# EAGLE design NEO-M8T GNSS FeatherWing (EAGLE 8.2.2)
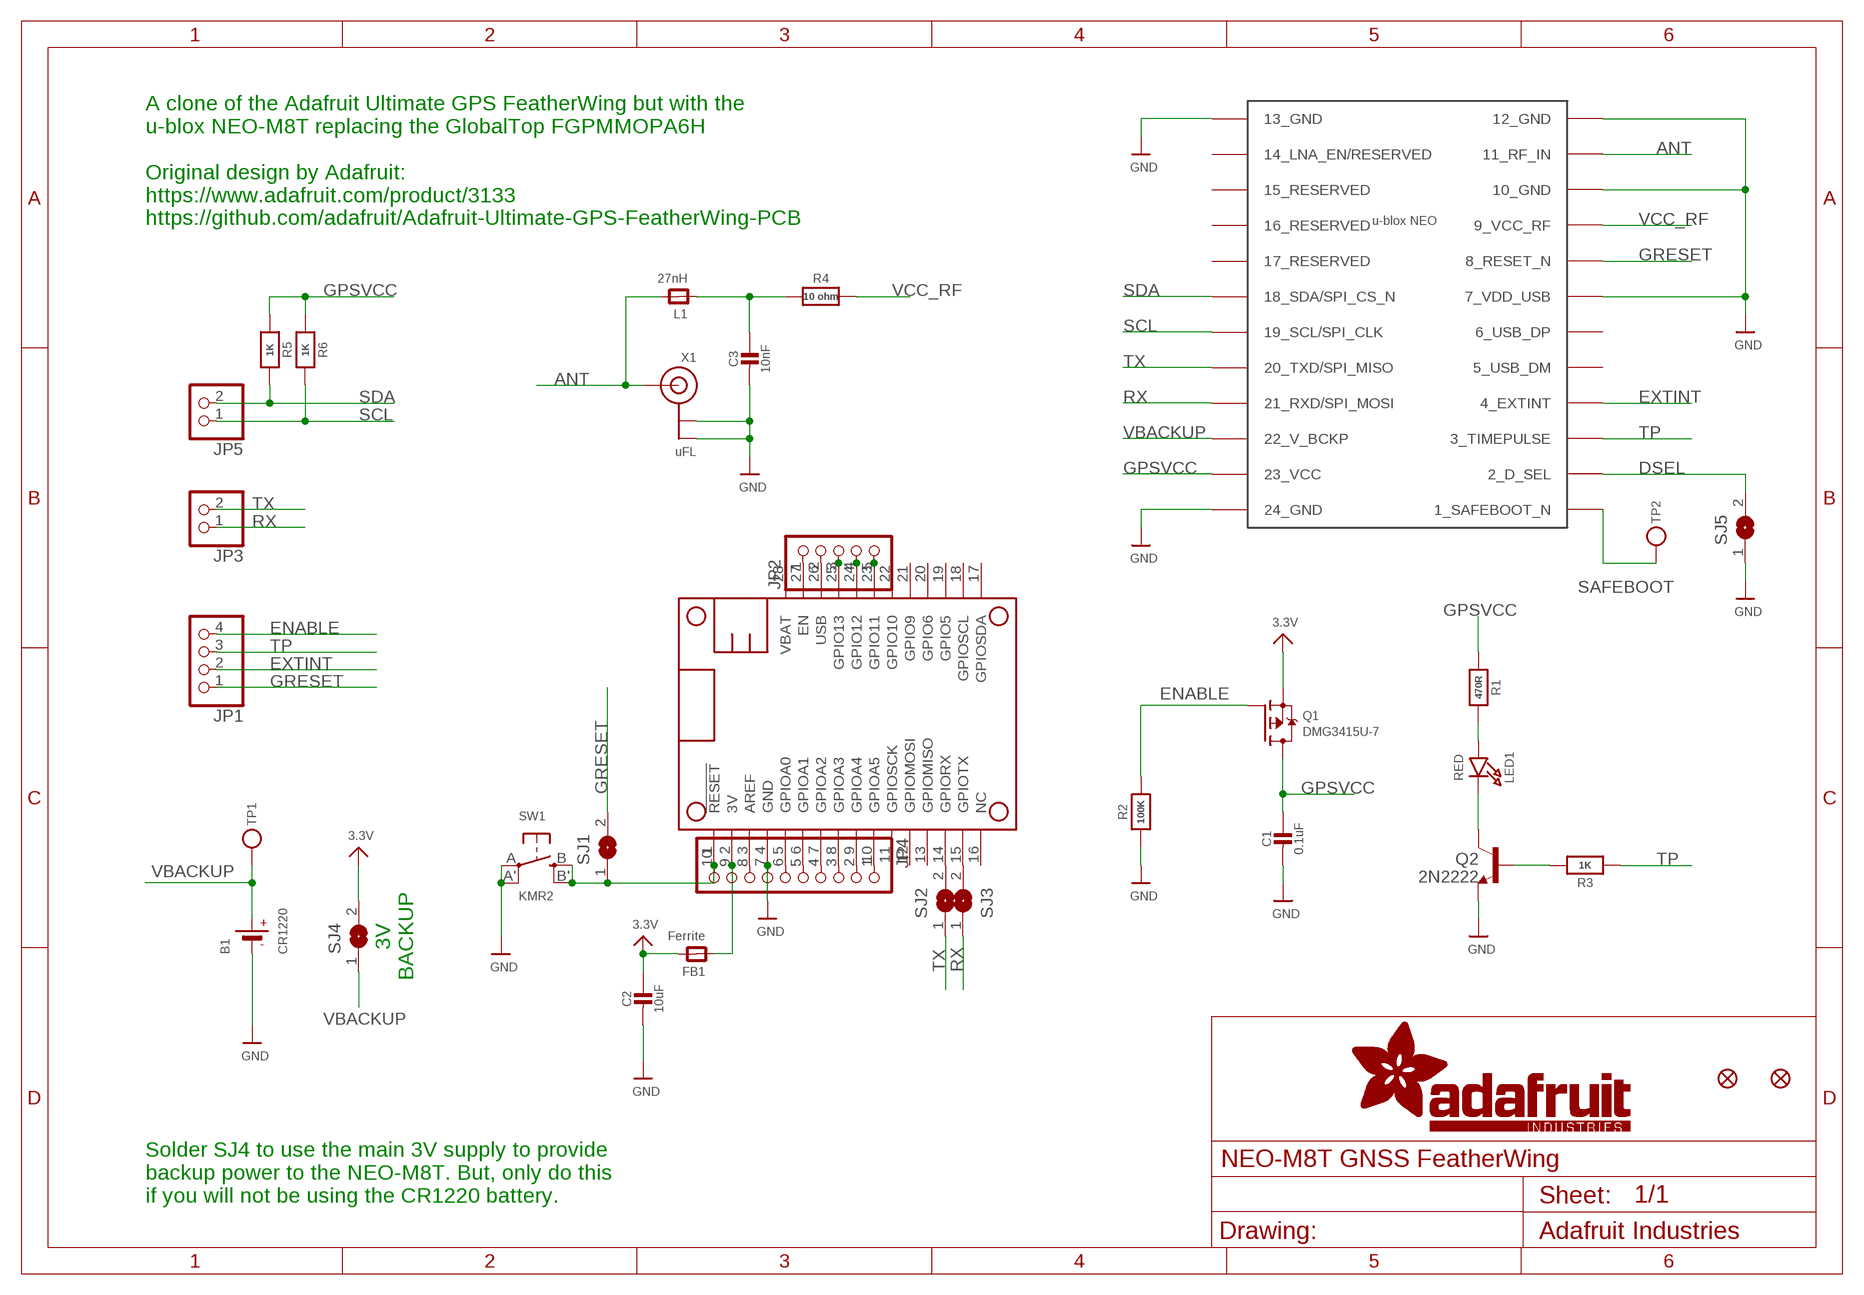
[diagram p0: schematic, sheet 1]

## Parts
B1  CR1220  BATTERYCR1220_2  [CR1220-2]
C1  0.1uF  CAP_CERAMIC0805-NOOUTLINE  [0805-NO]
C2  10uF  CAP_CERAMIC0805-NOOUTLINE  [0805-NO]
C3  10nF  CAP_CERAMIC0805-NOOUTLINE  [0805-NO]
FB1  Ferrite  FERRITE-0805NO  [0805-NO]
FID1  FIDUCIAL""  [FIDUCIAL_1MM]
FID2  FIDUCIAL""  [FIDUCIAL_1MM]
JP1  HEADER-1X4ROUND  [1X04_ROUND]
JP2  HEADER-1X570MIL  [1X05_ROUND_70]
JP3  HEADER-1X2ROUND  [1X02_ROUND]
JP4  HEADER-1X10ROUND  [1X10_ROUND]
JP5  HEADER-1X2ROUND  [1X02_ROUND]
L1  27nH  FERRITE-0805NO  [0805-NO]
LED1  RED  LED0805_NOOUTLINE  [CHIPLED_0805_NOOUTLINE]
MS1  FEATHERWING  [FEATHERWING]
Q1  DMG3415U-7  MOSFET-PWIDE  [SOT23-WIDE]
Q2  2N2222  MMBT2222ALT1-NPN-SOT23-BEC  [SOT23-BEC]
R1  470R  RESISTOR_0603_NOOUT  [0603-NO]
R2  100K  RESISTOR0805_NOOUTLINE  [0805-NO]
R3  1K  RESISTOR_0603_NOOUT  [0603-NO]
R4  10 ohm  RESISTOR0805_NOOUTLINE  [0805-NO]
R5  1K  RESISTOR_0603_NOOUT  [0603-NO]
R6  1K  RESISTOR_0603_NOOUT  [0603-NO]
SJ1  SOLDERJUMPER  [SOLDERJUMPER_ARROW_NOPASTE]
SJ2  SOLDERJUMPERCLOSED  [SOLDERJUMPER_CLOSEDWIRE]
SJ3  SOLDERJUMPERCLOSED  [SOLDERJUMPER_CLOSEDWIRE]
SJ4  SOLDERJUMPER  [SOLDERJUMPER_ARROW_NOPASTE]
SJ5  SOLDERJUMPER  [SOLDERJUMPER_ARROW_NOPASTE]
SW1  KMR2  SWITCH_TACT_SMT4.6X2.8  [BTN_KMR2_4.6X2.8]
TP1  TESTPOINTROUND1.5MM  [TESTPOINT_ROUND_1.5MM]
TP2  TESTPOINTROUND1.5MM  [TESTPOINT_ROUND_1.5MM]
U1  NEO-M8  [NEO-M8]
X1  uFL  ANTENNA_U.FL  [U.FL]

## Nets
3.3V: C2.1 FB1.2 Q1.2(S) SJ4.2
3V: FB1.1 JP4.9 MS1.2(3V)
ANT: L1.2 U1.11(11_RF_IN) X1.3(SIGNAL)
DSEL: SJ5.2 U1.2(2_D_SEL)
ENABLE: JP1.4 Q1.1(G) R2.2
EXTINT: JP1.2 U1.4(4_EXTINT)
GND: B1.- C1.2 C2.2 C3.2 JP4.7 MS1.4(GND) Q2.E R2.1 SJ5.1 SW1.A'(P1) SW1.A(P) U1.7(7_VDD_USB) U1.10(10_GND) U1.12(12_GND) U1.13(13_GND) U1.24(24_GND) X1.1(GND) X1.2(GND)
GPSVCC: C1.1 Q1.3(D) R1.1 R5.1 R6.1 U1.23(23_VCC)
GRESET: JP1.1 SJ1.2 U1.8(8_RESET_N)
N$1: JP2.3 MS1.25(GPIO13)
N$2: LED1.A R1.2
N$3: JP2.4 MS1.24(GPIO12)
N$4: C3.1 L1.1 R4.1
N$5: JP2.5 MS1.23(GPIO11)
N$6: JP4.1 MS1.10(GPIOA5)
N$7: JP4.2 MS1.9(GPIOA4)
N$8: JP4.3 MS1.8(GPIOA3)
N$9: JP4.4 MS1.7(GPIOA2)
N$10: JP4.5 MS1.6(GPIOA1)
N$11: JP4.6 MS1.5(GPIOA0)
N$13: JP4.8 MS1.3(AREF)
N$14: JP2.1 MS1.27(EN)
N$16: MS1.14(GPIORX) SJ2.2
N$17: MS1.15(GPIOTX) SJ3.2
N$18: LED1.C Q2.C
N$19: Q2.B R3.2
RST: JP4.10 MS1.1(!RESET) SJ1.1 SW1.B'(S1) SW1.B(S)
RX: JP3.1 SJ3.1 U1.21(21_RXD/SPI_MOSI)
SAFEBOOT: TP2.P$1 U1.1(1_SAFEBOOT_N)
SCL: JP5.1 R6.2 U1.19(19_SCL/SPI_CLK)
SDA: JP5.2 R5.2 U1.18(18_SDA/SPI_CS_N)
TP: JP1.3 R3.1 U1.3(3_TIMEPULSE)
TX: JP3.2 SJ2.1 U1.20(20_TXD/SPI_MISO)
USB: JP2.2 MS1.26(USB)
VBACKUP: B1.+ SJ4.1 TP1.P$1 U1.22(22_V_BCKP)
VCC_RF: R4.2 U1.9(9_VCC_RF)
Unconnected: MS1.11(GPIOSCK) MS1.12(GPIOMOSI) MS1.13(GPIOMISO) MS1.16(NC) MS1.17(GPIOSDA) MS1.18(GPIOSCL) MS1.19(GPIO5) MS1.20(GPIO6) MS1.21(GPIO9) MS1.22(GPIO10) MS1.28(VBAT) U1.5(5_USB_DM) U1.6(6_USB_DP) U1.14(14_LNA_EN/RESERVED) U1.15(15_RESERVED) U1.16(16_RESERVED) U1.17(17_RESERVED)

## Notes on the sheet
- A clone of the Adafruit Ultimate GPS FeatherWing but with the
  u-blox NEO-M8T replacing the GlobalTop FGPMMOPA6H
  
  Original design by Adafruit:
  https://www.adafruit.com/product/3133
  https://github.com/adafruit/Adafruit-Ultimate-GPS-FeatherWing-PCB
- 3V
  BACKUP
- Solder SJ4 to use the main 3V supply to provide
  backup power to the NEO-M8T. But, only do this
  if you will not be using the CR1220 battery.

## Library data of the parts
B1 = microbuilder:BATTERY: CR1220 SMT - Digikey: 3001K-ND CD2032 BAT-HLD-001 - Digikey: BAT-HLD-001-ND
C1-C3 = microbuilder:CAP_CERAMIC: Ceramic Capacitors For new designs, use the packages preceded by an '_' character since they are more reliable: The following footprints should be used on most boards: _0402 - Standard footprint for regular board layouts _0603 - Standard footprint for regular board layouts _0805 - Standard footprint for regular board layouts _1206 - Standard footprint for regular board layouts For extremely tight-pitch boards where space is at a premium, the following 'micro-pitch' footprints can be used (smaller pads, no silkscreen outline, etc.): _0402MP - Micro-pitch footprint for very dense/compact boards _0603MP - Micro-pitch footprint for very dense/compact boards _0805MP - Micro-pitch footprint for very dense/compact boards _1206MP - Micro-pitch footprint for very dense/compact boards
FB1 L1 = microbuilder:FERRITE: Ferrite Bead 0603 MMZ1608B121C - 120 Ohm @ 100MHz, 600mA, 0.15 Ohm DC Resistance - Digikey: 445-2164-1-ND BK1608HW121-T - 120 Ohm, 600mA Ferrite Chip - Digikey: 587-1876-2-ND 0805 HZ0805B272R-10 - 2.7K Ohm @ 100MHz, 200mA, 0.8 Ohm DC Resistance - Digikey: 240-2504-1-ND (see also Murata BLM21BD272SN1L) MMZ2012Y152B - 1.5K Ohm @ 100MHz, 500mA, 0.4 Ohm DC Resistance - Digikey: 445-1560-1-ND - Mainly for high frequency (80-400MHz) MMZ2012R102A - 1K Ohm @ 100MHz, 500mA, 0.3 Ohm DC Resistance - Digikey: 445-1555-2-ND - More general purpose (10-200MHz)
FID1 FID2 = microbuilder:FIDUCIAL: Fiducial Alignment Points Various fiducial points for machine vision alignment.; BOM: EXCLUDE
JP1 = microbuilder:HEADER-1X4: PIN HEADER
JP2 = microbuilder:HEADER-1X5: PIN HEADER
JP3 JP5 = microbuilder:HEADER-1X2: PIN HEADER
JP4 = microbuilder:HEADER-1X10: PIN HEADER
LED1 = microbuilder:LED: LED 0603 - 0603 Surface Mount Package 2mA: Green LED - Low Power (3.9mcd, 2ma, 1.7Vf) - Digikey: 475-2709-2-ND Orange LED - Low Power (9.8mcd, 2ma, 1.8Vf) - Digikey: 475-1194-2-ND Red LED - Low Power (5mcd, 2ma, 1.8Vf) - Digikey: 475-1195-2-ND Yellow LED - Low Power (7mcd, 2ma, 1.8Vf) - Digikey: 475-1196-2-ND 5mA: Blue LED - Low Power (17mcd, 5ma, 2.9Vf) - Digikey: LNJ937W8CRACT-ND 0805 - 0805 Surface Mount Package 2mA: Red LED (8.8mcd, 2mA, 1.8Vf, Clear) - Low Power [Digikey: 475-2510-1-ND] Green LED (5mcd, 2mA, 1.8Vf, Clear) - Low Power [Digikey: 475-2730-1-ND] Yellow LED (11.3mcd, 2mA, 1.8Vf, Clear) - Low Power [Digikey: 475-2555-1-ND] 20mA: Red LED (104mcd, 20mA, Diffused) - LS R976 [Digikey: 475-1278-6-ND] Red LED (12mcd, 20mA, 2.0Vf, Clear) - APT2012EC [Digikey: 754-1128-1-ND] Green LED (15mcd, 20mA, 2.2Vf, Clear) - APT2012GC [Digikey: 754-1131-1-ND] Orange LED (160mcd, 20mA, 2.1Vf, Clear) - APT2012SECK [Digikey: 754-1130-1-ND] 1206 - 1206 Surface Mount Package Green LED (26mcd, 20mA, Diffused) - LG N971 [Digikey: 475-1407-6-ND] Red LED (15mcd, 20mA, Diffused) - LH N974 [Digikey: 475-1416-6-ND] Cree - Cree High-Power Surface Mount LEDs XPEBWT-L1-0000-00D50 - White 111lm 350mA 2.9Vf 6200K 110° XTEAWT-00-0000-00000LEE3 - White 114lm 350mA 2.85Vf 5000K 115° Everlight - Everlight 45-21 Series Surface Mount LEDs 45-21/QK2C-B2832AC2CB2/2T - Warm White 2000mcd 20mA 3.25Vf 3050K 120° 45-21/LK2C-B38452C4CB2/2T - Nuetral White 2000mcd 20mA 3.25Vf 4150K 120° 45-21/LK2C-B50634C6CB2/2T - Cold White 2200mcd 20mA 3.25Vf 5650K 120° PLCC2 Reverse Mount LS T77K-J1L2-1-0-2-R18-Z - Red 11.25mcd 2mA 1.8Vf 630nm 120° LO T77K-L1M2-24-Z - Orange 19.6mcd 2mA 1.8Vf 606nm 120° LY T77K-K2M1-26-Z - Yellow 15.7mcd 2mA 1.8Vf 587nm 120°
MS1 = microbuilder:FEATHERWING
Q1 = microbuilder:MOSFET-P: P-Channel Mosfet LEGEND VDS: Voltage Drain-Source ID: Drain Current RDS(ON): Drain-Source On-State Resistance VGS(TH): Gate-Source Threshold Voltage CISS: Drain-Source Input Capacitance SOT-23 Name VDS ID RDS(ON) VGS(TH) CISS Order Number IRLML5103 30V 760mA 600 mOhm -- 75pF @ 25V Digikey: IRLML5103PBFCT-ND IRLML6401 12V 4.3A 50 mOhm 950mV @ 250µA 830pF @ 10V Digikey: IRLML6401PBFTR-ND NTR0202PL 20V 400mA 800 mOhm 2.3V @ 250uA 70pF @ 5V Digikey: NTR0202PLT1GOSTR-ND NTR4101PT1G 20V 1.8A 85 mOhm 1.2V @ 250uA 675pF @ 10V Digikey: NTR4101PT1GOSCT-ND DMP2004K 20V 600mA 900 mOhm 1V @ 250uA 175pF @ 16V Digikey: DMP2004KDICT-ND PMV65XP 20V 3.9A 76 mOhm 950mV @ 1mA 725pF @ 20V Digikey: 568-2358-2-ND TO-252 Name VDS ID RDS(ON) VGS(TH) CISS Order Number AOD417 30V 25A 34 mOhm 3V @ 250µA 920pF @ 15V Digikey: 785-1106-2-ND
Q2 = transistor:*-NPN-: NPN Transistror BF959 corrected 2008.03.06
R1-R6 = microbuilder:RESISTOR: Resistors For new designs, use the packages preceded by an '_' character since they are more reliable: The following footprints should be used on most boards: _0402 - Standard footprint for regular board layouts _0603 - Standard footprint for regular board layouts _0805 - Standard footprint for regular board layouts _1206 - Standard footprint for regular board layouts For extremely tight-pitch boards where space is at a premium, the following 'micro-pitch' footprints can be used (smaller pads, no silkscreen outline, etc.): _0402MP - Micro-pitch footprint for very dense/compact boards _0603MP - Micro-pitch footprint for very dense/compact boards _0805MP - Micro-pitch footprint for very dense/compact boards _1206MP - Micro-pitch footprint for very dense/compact boards
SJ1 SJ4 SJ5 = microbuilder:SOLDERJUMPER: SMD Solder JUMPER Solder the two pads together to create a connection, or remove the solder to break it. REFLOW - Use this footprint for solder paste and reflow ovens. WAVE - Use this footprint for hand-soldering (larger pads). CLOSED - Has a trace between the two pads to ensure it is closed by default. The trace needs to be cut to disable the jumper, and can be closed again by creating a solder bridge between the two pads.; BOM: EXCLUDE
SJ2 SJ3 = microbuilder:SOLDERJUMPER: SMD Solder JUMPER Solder the two pads together to create a connection, or remove the solder to break it. REFLOW - Use this footprint for solder paste and reflow ovens. WAVE - Use this footprint for hand-soldering (larger pads). CLOSED - Has a trace between the two pads to ensure it is closed by default. The trace needs to be cut to disable the jumper, and can be closed again by creating a solder bridge between the two pads.
SW1 = microbuilder:SWITCH_TACT_SMT: SMT Tact Switches 6x6mm - Digikey: P12940SCT-ND KMR2 (4.6x2.8mm) - Digikey: 401-1426-1-ND EVQ-PQHB55 - Light Touch, 160GF (4.5x4.5mm) - Digikey: P8090SCT-ND KMT0 - KMT021 NGJ LHS (etc.) IP68/Waterproof - Digikey: CKN10289CT-ND
TP1 TP2 = microbuilder:TESTPOINT: Test Point Various test points for characterisation and PCB testing TESTPOINT_SMT - Compact Surface Mount Test Point [Digikey: 5016KTR-ND]
U1 = ubloxLib:NEO-M8: u-blox NEO GNSS module
X1 = microbuilder:ANTENNA_U.FL: U.FL Antenna Connector

## Board
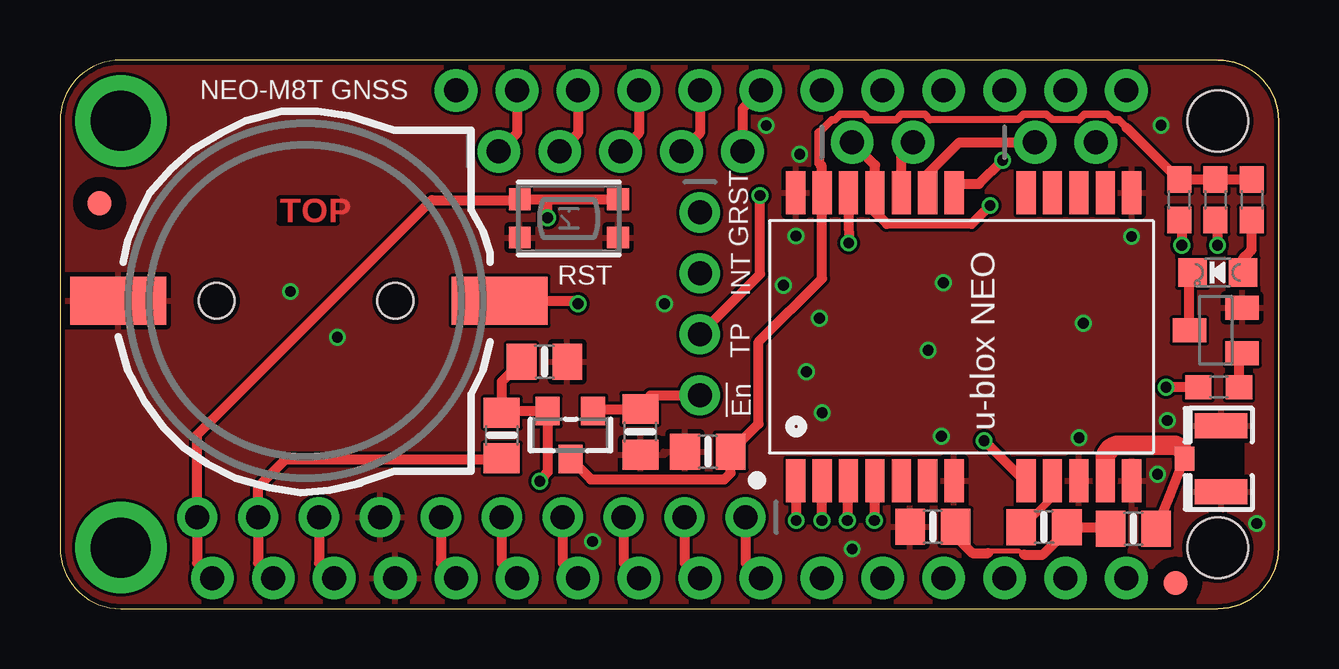
[diagram p1: board, top side]
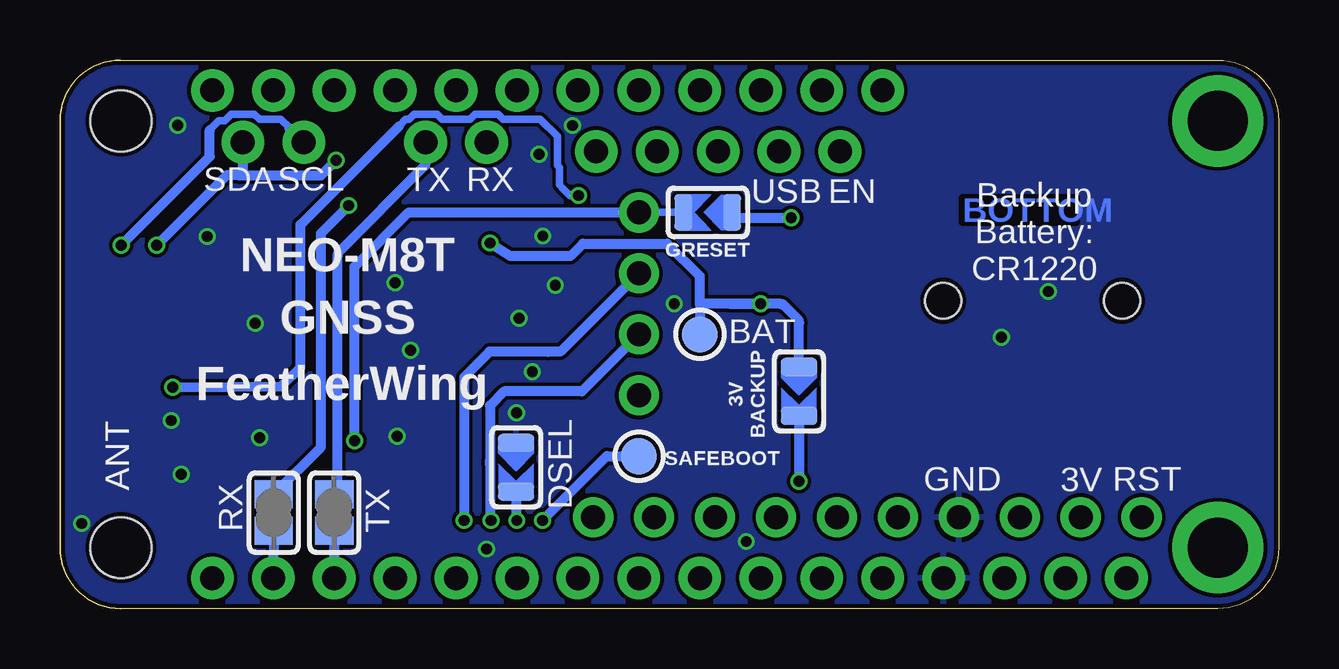
[diagram p2: board, bottom side, seen from below]

Size 50.8 x 22.86 mm. Coordinates in mm from the lower left corner, seen from the top.
Outline: 48.26,22.86 arc-90 50.8,20.32 50.8,2.54 arc-90 48.26,0
Copper layers (1*16): Top 0.018mm / dielectric 1.55mm / Bottom 0.018mm
Design rules "Multi-CB_2L_125um-Tracks_OL35um *": minimum track width 0.125mm, minimum drill 0.2mm, track to track 0.125mm, track to pad 0.125mm, pad to pad 0.125mm, via to via 0.125mm, smd to smd 0mil, copper to edge 0.2mm, drill to drill 0.2mm, minimum pad ring 0.125mm, minimum via ring 0.125mm, stop-mask expansion 2mil, vias tented up to drill 0.45mm, thermal gap 0.2mm

### Footprints (pad centres in the part's own frame; a part is rotated, then mirrored left to right if it is on the bottom)
CR1220-2 = smd 4 x 2: + 8.29,0; - -7.6,0 | hole 1.5: 3.95,0; -3.5,0
0805-NO = smd 1.24 x 1.5: 1 -0.95,0; 2 0.95,0
FIDUCIAL_1MM = smd 1 x 1: 1 0,0
1X04_ROUND = drill 1 pad 1.676: 1 -3.81,0; 2 -1.27,0; 3 1.27,0; 4 3.81,0
1X05_ROUND_70 = drill 1 pad 1.778: 1 -5.08,0; 2 -2.54,0; 3 0,0; 4 2.54,0; 5 5.08,0
1X02_ROUND = drill 1 pad 1.778: 1 -1.27,0; 2 1.27,0
1X10_ROUND = drill 1 pad 1.676: 1 -11.43,0; 2 -8.89,0; 3 -6.35,0; 4 -3.81,0; 5 -1.27,0; 6 1.27,0; 7 3.81,0; 8 6.35,0; 9 8.89,0; 10 11.43,0
CHIPLED_0805_NOOUTLINE = smd 1.2 x 1.2: A 0,-1.05; C 0,1.05
FEATHERWING = drill 1 pad 1.778: 1 6.35,1.27; 2 8.89,1.27; 3 11.43,1.27; 4 13.97,1.27; 5 16.51,1.27; 6 19.05,1.27; 7 21.59,1.27; 8 24.13,1.27; 9 26.67,1.27; 10 29.21,1.27; 11 31.75,1.27; 12 34.29,1.27; 13 36.83,1.27; 14 39.37,1.27; 15 41.91,1.27; 16 44.45,1.27; 17 44.45,21.59; 18 41.91,21.59; 19 39.37,21.59; 20 36.83,21.59; 21 34.29,21.59; 22 31.75,21.59; 23 29.21,21.59; 24 26.67,21.59; 25 24.13,21.59; 26 21.59,21.59; 27 19.05,21.59; 28 16.51,21.59 | drill 2.5 pad 3.81: P$1 2.54,20.32; P$2 2.54,2.54 | hole 2.54: 48.26,20.32; 48.26,2.54
SOT23-WIDE = smd 1 x 1.2: 1 -0.95,-1; 2 0.95,-1; 3 0,1
SOT23-BEC = smd 1 x 1.4: B -0.95,-1.1; C 0,1.1; E 0.95,-1.1
0603-NO = smd 1.1 x 1: 1 -0.85,0; 2 0.85,0
SOLDERJUMPER_ARROW_NOPASTE = smd 0.762 x 1.524: 1 -1.016,0; 2 1.016,0
SOLDERJUMPER_CLOSEDWIRE = smd 1.168 x 1.6: 1 -0.762,0; 2 0.762,0 | smd 0.635 x 0.203: WIRE 0,0
BTN_KMR2_4.6X2.8 = smd 0.9 x 0.9: A 2.05,0.8; A' -2.05,0.8; B 2.05,-0.8; B' -2.05,-0.8
TESTPOINT_ROUND_1.5MM = smd 1.5 x 1.5: P$1 0,0
NEO-M8 = smd 1.8 x 0.8: 1 6.4,-7.4; 2 6.4,-6.3; 3 6.4,-5.2; 4 6.4,-4.1; 5 6.4,-3; 6 6.4,-1.9; 7 6.4,-0.8; 8 6.4,2.2; 9 6.4,3.3; 10 6.4,4.4; 11 6.4,5.5; 12 6.4,6.6; 13 -5.6,6.6; 14 -5.6,5.5; 15 -5.6,4.4; 16 -5.6,3.3; 17 -5.6,2.2; 18 -5.6,-0.8; 19 -5.6,-1.9; 20 -5.6,-3; 21 -5.6,-4.1; 22 -5.6,-5.2; 23 -5.6,-6.3; 24 -5.6,-7.4
U.FL = smd 2.2 x 1.05: 1 0,1.375; 2 0,-1.375 | smd 0.8 x 1: 3 1.525,0

### Placement (x,y rotation side)
B1  10.03,12.83 0 top
C1  27.01,6.54 180 top
C2  20.19,10.29 0 top
C3  36.38,3.41 180 top
FB1  18.41,7.21 90 top
FID1  1.65,16.89 0 top
FID2  46.51,1.06 0 top
JP1  26.67,12.7 270 top
JP2  23.37,19.05 0 top
JP3  34.29,19.43 0 top
JP4  17.14,3.81 180 top
JP5  41.91,19.43 0 top
L1  44.74,3.33 0 top
LED1  48.26,14.01 90 top
MS1  0,0 0 top
Q1  21.28,7.24 180 top
Q2  48.18,11.6 90 top
R1  49.68,17.04 270 top
R2  24.19,7.37 90 top
R3  48.3,9.22 0 top
R4  41.01,3.4 180 top
R5  46.65,17.04 270 top
R6  48.16,17.04 270 top
SJ1  23.8,16.51 180 bottom
SJ2  39.37,4 270 bottom
SJ3  41.89,4 270 bottom
SJ4  20,9.05 270 bottom
SJ5  31.79,5.89 270 bottom
SW1  21.21,16.26 180 top
TP1  24.13,11.43 0 bottom
TP2  26.67,6.35 0 bottom
U1  38.07,11.73 270 top
X1  48.4,6.24 180 top

### Tracks (layer width: path | path; a pad name or v marks a point on that pad's centre or on a via)
3.3V  (via drill 0.45)
  Top 0.406: C2.1 18.41,9.46 FB1.2 18.49,8.24 Q1.2 20.33,5.69 v20,5.31
  Bottom 0.406: SJ4.2 v20,5.31
3V
  Top 0.406: MS1.2 8.26,1.91 JP4.9 8.26,5.08 9.4,6.22 18.37,6.22 FB1.1
ANT
  Top 0.406: L1.2 46.26,4.7 X1.3
  Top 0.813: X1.3 arc90 46.44,6.81 44.28,6.81 arc90 43.57,6.28 U1.11 arc90 U1.11
DSEL  (via drill 0.45)
  Top 0.406: v31.76,3.68 31.76,5.31 U1.2
  Bottom 0.406: SJ5.2 31.79,3.71 v31.76,3.68
ENABLE
  Top 0.406: Q1.1 22.49,8.32 R2.2 24.61,8.89 JP1.4
EXTINT  (via drill 0.45)
  Top 0.406: U1.4 33.95,5.34 v33.95,3.68
  Bottom 0.406: 30.5,10.7 30.44,10.7 | 30.5,10.7 32.9,10.7 33.95,9.65 v33.95,3.68 | JP1.2 29.94,10.7 30.5,10.7
GND  (via drill 0.45)
  other vias: 9.6,13.21 11.56,11.31 45.9,20.15 30.68,15.53 44.67,15.51 30.16,13.48 30.84,18.94 36.74,7.18 36.19,10.76 42.66,11.9 31.77,8.16 31.11,9.87 25.19,12.71 31.66,12.1 49.89,3.55 45.75,5.6 22.2,2.8 42.48,7.13 33.02,2.48 46.16,7.84 29.44,20.13 36.83,13.58
  pour Top (isolate 0.102): 0,22.86 0,0 50.8,0 50.8,22.86
  pour Bottom (isolate 0.152): 0,22.86 0,0 50.8,0 50.8,22.86
GPSVCC
  Top 0.305: 31.64,19.83 32.18,20.37 32.31,20.37 32.54,20.6 33.5,20.6 33.73,20.38 34.86,20.38 35.08,20.6 36.04,20.6 36.26,20.38 39.23,20.39 39.95,20.39 40.16,20.6 41.12,20.6 41.34,20.38 42.48,20.38 42.7,20.6 43.66,20.6 43.89,20.37 44.05,20.37 44.12,20.37 44.47,20.03
  Top 0.406: Q1.3 22.13,5.39 27.69,5.39 27.96,5.65 C1.1 29.12,7.7 29.12,11.11 31.77,13.75 U1.23 arc-45 31.74,17.4 31.74,18.48 31.64,18.57 31.64,19.48 31.64,19.83 | 44.47,20.03 46.6,17.9 R5.1 46.75,17.89 R6.1 R1.1
GRESET  (via drill 0.45)
  Top 0.406: U1.8 40.19,5.33 v38.52,6.99
  Bottom 0.305: JP1.1 SJ1.2
  Bottom 0.406: v38.52,6.99 38.52,14.25 36.27,16.51 27.18,16.51 JP1.1
N$1
  Top 0.406: MS1.25 24.13,19.81 JP2.3
N$2
  Top 0.406: 49.57,14.27 LED1.A 49.31,14.59 49.57,14.86 49.68,14.94 R1.2
N$3
  Top 0.406: MS1.24 26.67,19.81 JP2.4
N$4
  Top 0.152: 38.69,2.31 38.74,2.41
  Top 0.203: 40.18,2.25 39.96,2.41 38.74,2.41
  Top 0.406: C3.1 37.14,3.21 38.03,2.31 38.69,2.31 | 40.18,2.25 40.96,2.25 41.97,3.25 R4.1 43.72,3.4 L1.1
N$5
  Top 0.406: MS1.23 28.45,20.83 JP2.5
N$6
  Top 0.406: JP4.1 28.57,1.91 MS1.10
N$7
  Top 0.406: JP4.2 26.04,1.91 MS1.9
N$8
  Top 0.406: JP4.3 23.5,1.91 MS1.8
N$9
  Top 0.406: JP4.4 20.95,1.91 MS1.7
N$10
  Top 0.406: JP4.5 18.41,1.91 MS1.6
N$11
  Top 0.406: JP4.6 15.88,1.91 MS1.5
N$13
  Top 0.406: JP4.8 10.79,1.91 MS1.3
N$14
  Top 0.406: MS1.27 19.05,19.81 JP2.1
N$16
  Bottom 0.406: SJ2.2 MS1.14
N$17
  Bottom 0.406: SJ3.2 MS1.15
N$18
  Top 0.406: Q2.C 47.08,13.6 LED1.C
N$19
  Top 0.406: R3.2 49.15,10.52 Q2.B
RST  (via drill 0.45)
  Top 0.254: 19.12,17.02 SW1.B
  Top 0.406: MS1.1 5.71,1.91 JP4.10 5.71,7.24 15.49,17.02 19.12,17.02 | SW1.B 20.32,17.06 | 20.32,17.06 SW1.B' | v20.32,16.29 20.32,17.06
  Bottom 0.254: SJ1.1 22.78,16.29
  Bottom 0.406: 22.78,16.29 v20.32,16.29
RX  (via drill 0.45)
  Top 0.406: v38.77,16.8 38,16.03 34.46,16.03 33.93,16.56 33.93,17.29 U1.21 33.97,18.48 JP3.1
  Bottom 0.406: SJ3.1 39.92,6.74 39.92,15.64 v38.77,16.8
SAFEBOOT  (via drill 0.45)
  Top 0.406: U1.1 30.67,3.71 arc45 v30.68,3.68
  Bottom 0.406: v30.68,3.68 28.01,6.35 TP2.P$1
SCL  (via drill 0.45)
  Top 0.406: U1.19 36.17,18.01 arc-45 36.24,18.19 37.41,19.36 arc-45 37.59,19.43 JP5.1 | R6.2 48.25,16.18 v48.25,15.15
  Bottom 0.305: 44.55,19.95 44.18,20.32 43.94,20.32 43.66,20.6 42.7,20.6 42.47,20.39 41.59,20.39 41.23,20.03 41.23,20.01
  Bottom 0.406: v48.25,15.15 44.55,18.84 44.55,19.95 | 40.65,19.43 JP5.1 40.65,19.43 | 41.23,20.01 40.65,19.43
SDA  (via drill 0.45)
  Top 0.406: U1.18 37.64,17.7 38.31,17.7 v39.3,18.69 | R5.2 46.77,16.17 v46.77,15.15
  Bottom 0.406: v39.3,18.69 39.92,18.06 43.32,18.06 | v46.77,15.15 43.85,18.06 43.32,18.06 | JP5.2 43.18,18.2 43.32,18.06
TP  (via drill 0.45)
  Top 0.406: U1.3 32.83,5.28 v32.83,3.68 | v29.18,17.21 29.18,13.94 JP1.3 | R3.1 v46.1,9.22 | v46.1,9.22
  Bottom 0.305: 36.67,20.1 36.38,20.39 36.25,20.39 36.04,20.6 35.08,20.6 34.87,20.39 33.71,20.39 33.5,20.6 32.54,20.6 32.33,20.39 30.79,20.39 30.07,19.67 30.07,18.46 29.99,18.38 29.99,17.66 29.87,17.55 29.53,17.21 v29.18,17.21
  Bottom 0.406: v32.83,3.68 arc45 32.88,3.8 32.88,6.02 32.88,6.16 32.88,8.46 32.28,9.05 29.05,9.05 JP1.3 | v46.1,9.22 41.58,9.26 40.77,10.06 40.77,16 36.67,20.1
TX
  Top 0.406: U1.20 35.07,18.84 arc-45 35.14,19.02 JP3.2
  Bottom 0.406: SJ2.1 39.23,4.91 39.23,14.72 arc45 39.15,14.9 35.63,18.41 arc-45 35.56,18.59 JP3.2
USB
  Top 0.406: MS1.26 21.59,19.81 JP2.2
VBACKUP  (via drill 0.45)
  Top 0.406: B1.+ 21.46,12.83 v21.59,12.7 | U1.22 32.84,17.3 v32.88,15.23
  Bottom 0.406: v32.88,15.23 32.01,14.69 29.53,14.69 29,15.21 25.49,15.21 24.13,13.85 24.13,12.72 | SJ4.1 20,11.91 arc-45 20.07,12.09 20.61,12.63 arc-45 20.79,12.7 v21.59,12.7 | 22.86,12.7 v21.59,12.7 | 24.13,12.72 TP1.P$1 | 24.13,12.72 24.13,12.7 v21.59,12.7
VCC_RF
  Top 0.305: R4.2 40.06,3.34 41.37,4.64 U1.9

### Text on the board
Top: TOP
Bottom: BOTTOM
tPlace: NEO-M8T GNSS | GRST | INT | RST | TP | !En
bPlace: RX | TX | SCL | SDA | EN | USB | Backup / Battery: / CR1220 | GRESET | NEO-M8T | GNSS | BAT | FeatherWing | 3V / BACKUP | SAFEBOOT | DSEL | ANT | RST | 3V | GND | TX | RX
tDocu: JP3 | JP5 | LED1 | SW1 | C2 | U1 | Q2 | B1 | R2 | FB1 | X1 | Q1 | C1 | R4 | L1